# Altium project LimePSB-RPCM_1v4.PrjPcb (part 12 of 12)
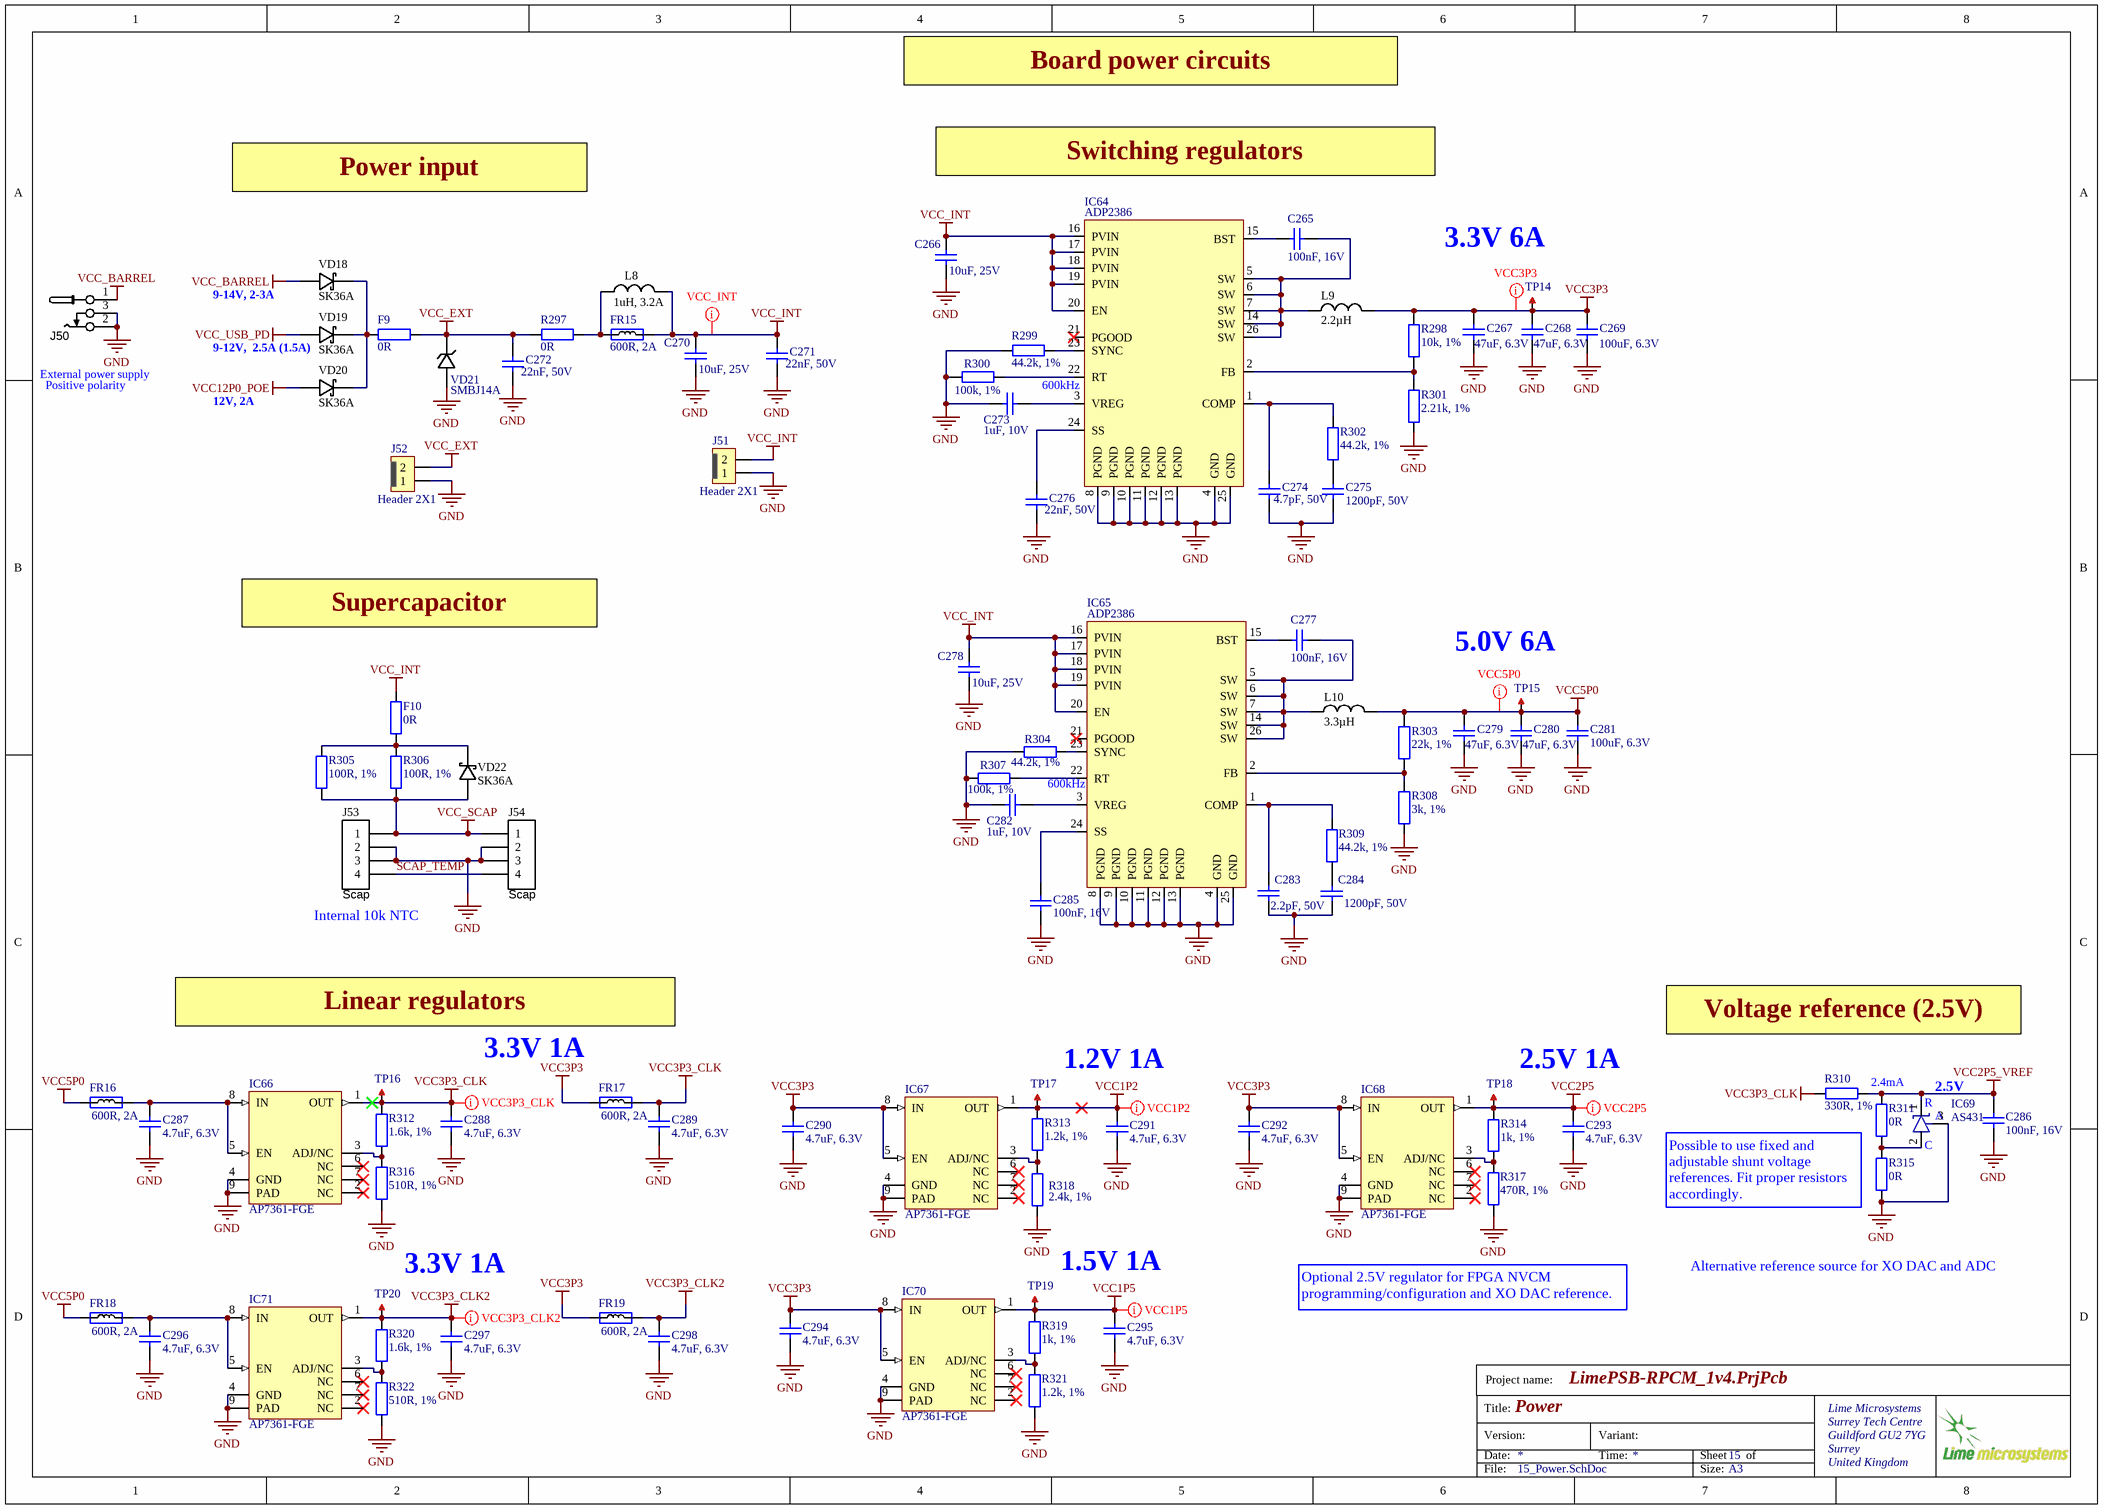
[diagram p16: 15_Power.SchDoc]

## Nets that join several sheets
GND: 05_RPi_mPCIe (86 pins), 06_Misc_1 (63 pins), 07_Misc_2 (82 pins), 08_FPGA (35 pins), 09_USB_hub (67 pins), 10_USB_HDMI (80 pins), 11_Clock_1 (82 pins), 12_Clock_2 (81 pins), 13_RFFE (136 pins), 14_RFPD_PoE_USB_PD (51 pins), 15_Power (80 pins)
USB_VBUS_IN: 09_USB_hub (6 pins), 14_RFPD_PoE_USB_PD (7 pins)
VCC1P2: 08_FPGA (7 pins), 15_Power (C291.2 IC67.1 R313.1 TP17.1)
VCC1P5: 05_RPi_mPCIe (J3.6 J3.28 J3.48), 15_Power (C295.2 IC70.1 R319.2 TP19.1)
VCC2P5: 08_FPGA (R117.2), 11_Clock_1 (R202.2), 14_RFPD_PoE_USB_PD (R329.2), 15_Power (C293.2 IC68.1 R314.2 TP18.1)
VCC2P5_VREF: 07_Misc_2 (R50.1), 11_Clock_1 (R197.2), 14_RFPD_PoE_USB_PD (R327.2), 15_Power (C286.2 IC69.1 R310.1 R311.1)
VCC3P0_BATT: 07_Misc_2 (BATT1.POSITIVE D1.A2 R87.2), 12_Clock_2 (J40.2 R258.2)
VCC3P3: 05_RPi_mPCIe (9 pins), 06_Misc_1 (26 pins), 07_Misc_2 (38 pins), 08_FPGA (20 pins), 09_USB_hub (28 pins), 10_USB_HDMI (9 pins), 12_Clock_2 (12 pins), 13_RFFE (R263.2 R264.2 R269.2 R270.2), 15_Power (17 pins)
VCC3P3_CLK: 11_Clock_1 (19 pins), 12_Clock_2 (10 pins), 14_RFPD_PoE_USB_PD (FR21.2 FR23.2 R328.1), 15_Power (7 pins)
VCC3P3_CLK2: 12_Clock_2 (FR9.1 FR10.1 FR11.1 FR12.1), 15_Power (6 pins)
VCC5P0: 05_RPi_mPCIe (8 pins), 06_Misc_1 (6 pins), 07_Misc_2 (6 pins), 09_USB_hub (8 pins), 10_USB_HDMI (11 pins), 13_RFFE (FR13.1 FR14.1), 15_Power (8 pins)
VCC12P0_POE: 07_Misc_2 (R58.1), 14_RFPD_PoE_USB_PD (C320.1 C321.2 L13.2 TP21.1), 15_Power (VD20.A)
VCC_BARREL: 07_Misc_2 (R56.1), 15_Power (J50.1 VD18.A)
VCC_EXT: 07_Misc_2 (R59.1), 15_Power (5 pins)
VCC_INT: 07_Misc_2 (R60.1 R89.1), 15_Power (18 pins)
VCC_SCAP: 07_Misc_2 (R61.1), 15_Power (5 pins)
VCC_USB_PD: 07_Misc_2 (R57.1), 14_RFPD_PoE_USB_PD (C329.2 IC75.5 IC75.6 IC76.11), 15_Power (VD19.A)
ADF_MUXOUT: 07_Misc_2 (IC15.1), 11_Clock_1 (IC37.15 R205.1)
ADF_REFIN_SEL: 07_Misc_2 (IC15.20), 11_Clock_1 (IC33.6)
BUZZER: 05_RPi_mPCIe (J1.34), 06_Misc_1 (R30.1 R33.1 VT1.G)
CAM1_CLK_N: 05_RPi_mPCIe (J2.27), 06_Misc_1 (J16.8)
CAM1_CLK_P: 05_RPi_mPCIe (J2.29), 06_Misc_1 (J16.9)
CAM1_D0_N: 05_RPi_mPCIe (J2.15), 06_Misc_1 (J16.2)
CAM1_D0_P: 05_RPi_mPCIe (J2.17), 06_Misc_1 (J16.3)
CAM1_D1_N: 05_RPi_mPCIe (J2.21), 06_Misc_1 (J16.5)
CAM1_D1_P: 05_RPi_mPCIe (J2.23), 06_Misc_1 (J16.6)
CAM1_GPIO0: 05_RPi_mPCIe (J1.97), 06_Misc_1 (J16.11)
DSI1_CLK_N: 05_RPi_mPCIe (J2.87), 06_Misc_1 (J15.5)
DSI1_CLK_P: 05_RPi_mPCIe (J2.89), 06_Misc_1 (J15.6)
DSI1_D0_N: 05_RPi_mPCIe (J2.75), 06_Misc_1 (J15.8)
DSI1_D0_P: 05_RPi_mPCIe (J2.77), 06_Misc_1 (J15.9)
DSI1_D1_N: 05_RPi_mPCIe (J2.81), 06_Misc_1 (J15.2)
DSI1_D1_P: 05_RPi_mPCIe (J2.83), 06_Misc_1 (J15.3)
EN_CM5_USB3: 05_RPi_mPCIe (IC1.6), 06_Misc_1 (DSW1.4), 08_FPGA (IC18.4), 10_USB_HDMI (6 pins)
EN_RXA_LNA: 07_Misc_2 (IC12.26), 13_RFFE (IC61.3 R276.2 R286.1)
EN_RXB_LNA: 07_Misc_2 (IC12.28), 13_RFFE (IC63.3 R278.2 R288.1)
EN_TXA_PA: 07_Misc_2 (IC12.25), 13_RFFE (IC60.3 R275.2 R285.1)
EN_TXB_PA: 07_Misc_2 (IC12.27), 13_RFFE (IC62.3 R277.2 R287.1)
ETH_LED_G: 05_RPi_mPCIe (J1.17), 06_Misc_1 (R31.2)
ETH_LED_Y: 05_RPi_mPCIe (J1.15), 06_Misc_1 (R32.2)
ETH_TRD0_N: 05_RPi_mPCIe (J1.10), 06_Misc_1 (J9.2 VD2.A)
ETH_TRD0_P: 05_RPi_mPCIe (J1.12), 06_Misc_1 (J9.1 VD1.A)
ETH_TRD1_N: 05_RPi_mPCIe (J1.6), 06_Misc_1 (J9.6 VD4.A)
ETH_TRD1_P: 05_RPi_mPCIe (J1.4), 06_Misc_1 (J9.3 VD3.A)
ETH_TRD2_N: 05_RPi_mPCIe (J1.9), 06_Misc_1 (J9.8 VD6.A)
ETH_TRD2_P: 05_RPi_mPCIe (J1.11), 06_Misc_1 (J9.7 VD5.A)
ETH_TRD3_N: 05_RPi_mPCIe (J1.5), 06_Misc_1 (J9.10 VD8.A)
ETH_TRD3_P: 05_RPi_mPCIe (J1.3), 06_Misc_1 (J9.9 VD7.A)
ETH_VC1: 06_Misc_1 (J9.11 J13.2), 14_RFPD_PoE_USB_PD (BR1.4)
ETH_VC2: 06_Misc_1 (J9.12 J13.1), 14_RFPD_PoE_USB_PD (BR1.3)
ETH_VC3: 06_Misc_1 (J9.13 J13.4), 14_RFPD_PoE_USB_PD (BR2.4)
ETH_VC4: 06_Misc_1 (J9.14 J13.3), 14_RFPD_PoE_USB_PD (BR2.3)
EXT_SYNC_IN: 11_Clock_1 (IC33.3 J36.1 R187.2), 12_Clock_2 (6 pins)
EXT_SYNC_OUT_A0: 07_Misc_2 (IC15.17), 11_Clock_1 (IC32.1)
EXT_SYNC_OUT_A1: 07_Misc_2 (IC15.18), 11_Clock_1 (IC32.10)
EXT_SYNC_OUT_EN: 07_Misc_2 (IC15.19), 11_Clock_1 (IC32.5)
FPGA_CDONE: 07_Misc_2 (IC15.26), 08_FPGA (IC18.7 J28.3 R107.1 R108.1)
FPGA_CDONE_LED: 07_Misc_2 (IC15.27), 08_FPGA (R104.1)
FPGA_CRESET: 07_Misc_2 (IC15.25), 08_FPGA (C54.1 IC18.8 J28.2 R109.2)
FPGA_GPIO0: 06_Misc_1 (J10.12), 08_FPGA (IC18.45)
FPGA_GPIO1: 06_Misc_1 (J10.14), 08_FPGA (IC18.21)
FPGA_RF_SW_TDD: 07_Misc_2 (R43.2), 08_FPGA (IC18.13)
FPGA_SPI0_DAC_SS: 08_FPGA (IC18.42), 11_Clock_1 (R214.2)
FPGA_SPI0_MOSI: 08_FPGA (IC18.38), 11_Clock_1 (R216.2)
FPGA_SPI0_SCLK: 08_FPGA (IC18.43), 11_Clock_1 (R215.2)
FPGA_SYNC_OUT: 08_FPGA (IC18.3), 12_Clock_2 (IC42.1 R229.2)
GNSS _DDC_SCL: 08_FPGA (IC18.28), 12_Clock_2 (IC48.19)
GNSS _DDC_SDA: 08_FPGA (IC18.27), 12_Clock_2 (IC48.18)
GNSS_EXTINT: 08_FPGA (IC18.25), 12_Clock_2 (IC48.4)
GNSS_RESET: 08_FPGA (IC18.23), 12_Clock_2 (R252.1)
GNSS_RF_IN: 07_Misc_2 (R69.2), 12_Clock_2 (C199.1 L1.1 R248.2)
GNSS_TPULSE: 08_FPGA (IC18.20), 12_Clock_2 (IC48.3)
GNSS_UART_RX: 08_FPGA (IC18.32), 12_Clock_2 (IC48.21)
GNSS_UART_TX: 08_FPGA (IC18.31), 12_Clock_2 (IC48.20)
GNSS_USB_D_N: 09_USB_hub (R138.1), 12_Clock_2 (IC48.5)
GNSS_USB_D_P: 09_USB_hub (R136.1), 12_Clock_2 (IC48.6)
HDMI0_CEC: 05_RPi_mPCIe (J2.51), 10_USB_HDMI (ESD15.1 J34.15)
HDMI0_CLK_N: 05_RPi_mPCIe (J2.90), 10_USB_HDMI (ESD14.1 J34.14)
HDMI0_CLK_P: 05_RPi_mPCIe (J2.88), 10_USB_HDMI (ESD13.1 J34.12)
HDMI0_D0_N: 05_RPi_mPCIe (J2.84), 10_USB_HDMI (ESD12.1 J34.11)
HDMI0_D0_P: 05_RPi_mPCIe (J2.82), 10_USB_HDMI (ESD11.1 J34.9)
HDMI0_D1_N: 05_RPi_mPCIe (J2.78), 10_USB_HDMI (ESD10.1 J34.8)
HDMI0_D1_P: 05_RPi_mPCIe (J2.76), 10_USB_HDMI (ESD9.1 J34.6)
HDMI0_D2_N: 05_RPi_mPCIe (J2.72), 10_USB_HDMI (ESD8.1 J34.5)
HDMI0_D2_P: 05_RPi_mPCIe (J2.70), 10_USB_HDMI (ESD7.1 J34.3)
HDMI0_HPD: 05_RPi_mPCIe (J2.53), 10_USB_HDMI (ESD18.1 J34.1)
HDMI0_SCL: 05_RPi_mPCIe (J2.100), 10_USB_HDMI (ESD16.1 J34.17)
HDMI0_SDA: 05_RPi_mPCIe (J2.99), 10_USB_HDMI (ESD17.1 J34.18)
HDMI1_CEC: 05_RPi_mPCIe (J2.49), 10_USB_HDMI (ESD27.1 J35.15)
HDMI1_CLK_N: 05_RPi_mPCIe (J2.66), 10_USB_HDMI (ESD26.1 J35.14)
HDMI1_CLK_P: 05_RPi_mPCIe (J2.64), 10_USB_HDMI (ESD25.1 J35.12)
HDMI1_D0_N: 05_RPi_mPCIe (J2.60), 10_USB_HDMI (ESD24.1 J35.11)
HDMI1_D0_P: 05_RPi_mPCIe (J2.58), 10_USB_HDMI (ESD23.1 J35.9)
HDMI1_D1_N: 05_RPi_mPCIe (J2.54), 10_USB_HDMI (ESD22.1 J35.8)
HDMI1_D1_P: 05_RPi_mPCIe (J2.52), 10_USB_HDMI (ESD21.1 J35.6)
HDMI1_D2_N: 05_RPi_mPCIe (J2.48), 10_USB_HDMI (ESD20.1 J35.5)
HDMI1_D2_P: 05_RPi_mPCIe (J2.46), 10_USB_HDMI (ESD19.1 J35.3)
HDMI1_HPD: 05_RPi_mPCIe (J2.43), 10_USB_HDMI (ESD30.1 J35.1)
HDMI1_SCL: 05_RPi_mPCIe (J2.47), 10_USB_HDMI (ESD28.1 J35.17)
HDMI1_SDA: 05_RPi_mPCIe (J2.45), 10_USB_HDMI (ESD29.1 J35.18)
LMK10_CLK_OUT0: 08_FPGA (IC18.37), 12_Clock_2 (IC39.3)
LMK10_CLK_OUT2: 11_Clock_1 (IC33.1 R186.2), 12_Clock_2 (IC39.13)
LMK10_CLK_OUT3: 11_Clock_1 (IC32.4), 12_Clock_2 (IC39.15)
LMKRF_CLK_OUT2: 11_Clock_1 (IC31.13), 12_Clock_2 (IC45.3 R240.2)
LMKRF_CLK_OUT4: 08_FPGA (IC18.35), 11_Clock_1 (IC31.17)
PCIE_COEX2: 05_RPi_mPCIe (J3.5 R4.1), 12_Clock_2 (IC40.1 R221.2)
PCIE_LED_WLAN: 05_RPi_mPCIe (J3.44), 07_Misc_2 (IC15.3)
PCIE_LED_WPAN: 05_RPi_mPCIe (J3.46), 07_Misc_2 (IC15.4)
PCIE_LED_WWAN: 05_RPi_mPCIe (J3.42), 07_Misc_2 (IC15.2)
PCIE_PPS_IN: 05_RPi_mPCIe (R3.2 R4.2 R5.2), 12_Clock_2 (IC43.4 R230.1 R233.1)
PCIE_PPS_IN_SEL: 07_Misc_2 (IC15.24), 12_Clock_2 (IC43.6)
PCIE_PPS_OUT: 11_Clock_1 (IC32.9), 12_Clock_2 (5 pins)
PCIE_PPS_OUT_SEL: 07_Misc_2 (IC15.23), 12_Clock_2 (IC40.6)
PCIE_SMB_CLK: 05_RPi_mPCIe (J3.30 R12.1), 12_Clock_2 (IC40.3 R224.2)
PCIE_UIM8: 05_RPi_mPCIe (J3.17), 08_FPGA (IC18.46)
PCIE_UIMC4: 05_RPi_mPCIe (R2.1), 12_Clock_2 (IC45.4 R239.1 R240.1)
PCIE_UIMC4_SEL: 07_Misc_2 (IC15.22), 12_Clock_2 (IC45.6)
PCIE_USB_N: 05_RPi_mPCIe (J3.36), 09_USB_hub (R126.2 R130.1)
PCIE_USB_P: 05_RPi_mPCIe (J3.38), 09_USB_hub (R125.2 R127.1)
PTP_SYNC_SEL: 07_Misc_2 (IC12.3), 12_Clock_2 (IC47.10 R254.1)
RF_SW_TDD: 07_Misc_2 (J18.2 R41.2 R43.1 R44.1), 13_RFFE (R261.2 R262.2 R267.2 R268.2)
RFPD_EN: 07_Misc_2 (IC15.28), 14_RFPD_PoE_USB_PD (IC72.9 IC73.9)
RFPDA_CONV: 05_RPi_mPCIe (J1.41), 14_RFPD_PoE_USB_PD (IC72.12)
RFPDA_RFIN: 13_RFFE (IC53.6), 14_RFPD_PoE_USB_PD (C302.1 L11.1)
RFPDB_CONV: 05_RPi_mPCIe (J1.24), 14_RFPD_PoE_USB_PD (IC73.12)
RFPDB_RFIN: 13_RFFE (IC55.6), 14_RFPD_PoE_USB_PD (C313.1 L12.1)
RPI_AIP0: 05_RPi_mPCIe (J1.96), 06_Misc_1 (J12.5)
RPI_AIP1: 05_RPi_mPCIe (J1.94), 06_Misc_1 (J12.6)
RPI_BTN1: 05_RPi_mPCIe (J1.45), 06_Misc_1 (R29.1)
RPI_BTN2: 05_RPi_mPCIe (J1.47), 06_Misc_1 (C10.1 J8.5 R15.2)
RPI_EEPROM_nWP: 05_RPi_mPCIe (J1.20), 06_Misc_1 (J12.4 R34.2)
RPI_GLOBAL_EN: 05_RPi_mPCIe (J1.99 J5.1), 06_Misc_1 (J12.14), 07_Misc_2 (R102.1)
RPI_GPIO2: 05_RPi_mPCIe (J1.58), 06_Misc_1 (J10.15)
RPI_GPIO3: 05_RPi_mPCIe (J1.56), 06_Misc_1 (J10.6)
RPI_GPIO4: 05_RPi_mPCIe (J1.54), 06_Misc_1 (J10.16)
RPI_GPIO6: 05_RPi_mPCIe (J1.30), 06_Misc_1 (J10.7)
RPI_GPIO22: 05_RPi_mPCIe (J1.46), 06_Misc_1 (J10.3)
RPI_GPIO27: 05_RPi_mPCIe (J1.48), 06_Misc_1 (J10.5)
RPI_I2C0_SCL: 05_RPi_mPCIe (J1.80 R12.2), 06_Misc_1 (J15.11 J16.13), 07_Misc_2 (12 pins), 08_FPGA (R111.1), 09_USB_hub (R154.2), 14_RFPD_PoE_USB_PD (R349.2)
RPI_I2C0_SDA: 05_RPi_mPCIe (J1.82 R13.2), 06_Misc_1 (J15.12 J16.14), 07_Misc_2 (12 pins), 08_FPGA (R112.1), 09_USB_hub (R153.2), 14_RFPD_PoE_USB_PD (R348.2)
RPI_ID_SC: 05_RPi_mPCIe (J1.35), 06_Misc_1 (J8.3 J10.18 R19.1)
RPI_ID_SD: 05_RPi_mPCIe (J1.36), 06_Misc_1 (J8.4 J10.17 R16.1)
RPI_LED_nPWR: 05_RPi_mPCIe (J1.95), 06_Misc_1 (IC2.2 R14.2 R17.2)
RPI_nEXTRST: 05_RPi_mPCIe (J1.100), 09_USB_hub (R132.2)
RPI_nRPIBOOT: 05_RPi_mPCIe (J1.93), 06_Misc_1 (DSW1.1 J12.2)
RPI_PIN16: 05_RPi_mPCIe (J1.16), 12_Clock_2 (IC47.2 R245.2 R251.1)
RPI_PIN18: 05_RPi_mPCIe (J1.18), 12_Clock_2 (IC47.1 R244.2 R250.1)
RPI_PIN111: 05_RPi_mPCIe (IC1.4 J2.11 R9.2 R11.2), 06_Misc_1 (J12.11)
RPI_PWM0: 05_RPi_mPCIe (J1.31), 06_Misc_1 (IC5.3)
RPI_PWM1: 05_RPi_mPCIe (J1.28), 06_Misc_1 (IC5.1)
RPI_RUN_PG: 05_RPi_mPCIe (J1.92 J5.3), 06_Misc_1 (IC3.2 J12.10 R22.2 R27.1)
RPI_SD_CLK: 05_RPi_mPCIe (J1.57), 06_Misc_1 (J7.5)
RPI_SD_CMD: 05_RPi_mPCIe (J1.62), 06_Misc_1 (J7.3)
RPI_SD_D0: 05_RPi_mPCIe (J1.63), 06_Misc_1 (J7.7)
RPI_SD_D1: 05_RPi_mPCIe (J1.67), 06_Misc_1 (J7.8)
RPI_SD_D2: 05_RPi_mPCIe (J1.69), 06_Misc_1 (J7.1)
RPI_SD_D3: 05_RPi_mPCIe (J1.61), 06_Misc_1 (J7.2)
RPI_SD_PWR_ON: 05_RPi_mPCIe (J1.75), 06_Misc_1 (IC4.3 R23.1)
RPI_SPI0_MISO: 05_RPi_mPCIe (J1.40), 06_Misc_1 (J10.11), 08_FPGA (R116.2 R118.1), 14_RFPD_PoE_USB_PD (IC72.1 IC73.1)
RPI_SPI0_MOSI: 05_RPi_mPCIe (J1.44), 06_Misc_1 (J10.9), 08_FPGA (R114.2 R115.1), 11_Clock_1 (R211.1)
RPI_SPI0_SCLK: 05_RPi_mPCIe (J1.38), 06_Misc_1 (J10.13), 08_FPGA (R113.1), 11_Clock_1 (R209.1), 14_RFPD_PoE_USB_PD (IC72.2 IC73.2)
RPI_SPI0_SS0: 05_RPi_mPCIe (J1.39), 08_FPGA (R119.2)
RPI_SPI0_SS1: 05_RPi_mPCIe (J1.37), 11_Clock_1 (R212.1)
RPI_SPI1_MISO: 05_RPi_mPCIe (J1.26), 07_Misc_2 (IC6.12), 08_FPGA (IC18.10)
RPI_SPI1_MOSI: 05_RPi_mPCIe (J1.27), 07_Misc_2 (IC6.11), 08_FPGA (IC18.9)
RPI_SPI1_SCLK: 05_RPi_mPCIe (J1.25), 07_Misc_2 (IC6.13), 08_FPGA (IC18.6)
RPI_SPI1_SS0: 05_RPi_mPCIe (J1.49), 07_Misc_2 (IC6.10)
RPI_SPI1_SS1: 05_RPi_mPCIe (J1.50), 08_FPGA (IC18.11)
RPI_SPI1_SS2: 05_RPi_mPCIe (J1.29), 08_FPGA (IC18.12)
RPI_STATUS_LED_G: 06_Misc_1 (IC2.4 R17.1), 07_Misc_2 (R91.1)
RPI_STATUS_LED_R: 05_RPi_mPCIe (J1.21), 07_Misc_2 (R95.1)
RPI_SYNC_IN: 06_Misc_1 (J12.8), 08_FPGA (IC18.2), 12_Clock_2 (6 pins)
RPI_SYNC_IN_SEL: 07_Misc_2 (IC15.21), 12_Clock_2 (IC41.6)
RPI_SYNC_OUT: 06_Misc_1 (J12.9), 08_FPGA (IC18.44), 12_Clock_2 (IC42.3 IC46.4 R232.2 R247.1)
RPI_TVDAC: 05_RPi_mPCIe (IC1.3 R11.1), 06_Misc_1 (J14.1 J17.4)
RPI_UART0_RX: 05_RPi_mPCIe (J1.51), 06_Misc_1 (J10.10 J11.3), 08_FPGA (IC18.34)
RPI_UART0_TX: 05_RPi_mPCIe (J1.55), 06_Misc_1 (J10.8 J11.2), 08_FPGA (IC18.36)
RPI_USB3_D0_N: 05_RPi_mPCIe (J2.36), 10_USB_HDMI (IC26.7)
RPI_USB3_D0_P: 05_RPi_mPCIe (J2.34), 10_USB_HDMI (IC26.6)
RPI_USB3_D1_N: 05_RPi_mPCIe (J2.65), 10_USB_HDMI (IC27.7)
RPI_USB3_D1_P: 05_RPi_mPCIe (J2.63), 10_USB_HDMI (IC27.6)
RPI_USB3_RX0_N: 05_RPi_mPCIe (J2.28), 10_USB_HDMI (IC29.4)
RPI_USB3_RX0_P: 05_RPi_mPCIe (J2.30), 10_USB_HDMI (IC29.5)
RPI_USB3_RX1_N: 05_RPi_mPCIe (J2.57), 10_USB_HDMI (IC30.4)
RPI_USB3_RX1_P: 05_RPi_mPCIe (J2.59), 10_USB_HDMI (IC30.5)
RPI_USB3_TX0_N: 05_RPi_mPCIe (J2.40), 10_USB_HDMI (IC29.1)
RPI_USB3_TX0_P: 05_RPi_mPCIe (J2.42), 10_USB_HDMI (IC29.2)
RPI_USB3_TX1_N: 05_RPi_mPCIe (J2.69), 10_USB_HDMI (IC30.1)
RPI_USB3_TX1_P: 05_RPi_mPCIe (J2.71), 10_USB_HDMI (IC30.2)
RPI_USB_D_N: 05_RPi_mPCIe (J2.3), 09_USB_hub (IC21.2 R152.2)
RPI_USB_D_P: 05_RPi_mPCIe (J2.5), 09_USB_hub (IC21.1 R151.2)
RPI_USB_OTG_ID: 05_RPi_mPCIe (J2.1), 09_USB_hub (R137.1 R145.2)
RPI_VBAT: 05_RPi_mPCIe (J1.76), 07_Misc_2 (R87.1)
RPI_VBUS_EN: 05_RPi_mPCIe (IC1.1 R9.1), 10_USB_HDMI (R167.2)
SCAP_TEMP: 07_Misc_2 (C32.1 IC6.7 R48.2 R53.1), 15_Power (J53.4 J54.4)
SYNC_OUT: 11_Clock_1 (IC32.2), 12_Clock_2 (5 pins)
SYNC_OUT_SEL: 07_Misc_2 (IC12.2), 12_Clock_2 (IC42.6)
USB3H_1_D_N: 09_USB_hub (J31.5 VD12.A), 10_USB_HDMI (IC27.1)
USB3H_1_D_P: 09_USB_hub (J31.3 VD13.A), 10_USB_HDMI (IC27.2)
USB3H_1_RX_N: 09_USB_hub (ESD3.1 J31.17), 10_USB_HDMI (IC30.9)
USB3H_1_RX_P: 09_USB_hub (ESD4.1 J31.15), 10_USB_HDMI (IC30.8)
USB3H_1_TX_N: 09_USB_hub (ESD5.1 J31.11), 10_USB_HDMI (C106.2)
USB3H_1_TX_P: 09_USB_hub (ESD6.1 J31.9), 10_USB_HDMI (C108.2)
USB_C_RPI1: 06_Misc_1 (DSW1.2), 09_USB_hub (J30.1 R144.1 R149.1)
USB_C_RPI2: 06_Misc_1 (DSW1.7), 09_USB_hub (J30.2 R139.1 R140.1 R144.2)
USB_CC1: 09_USB_hub (J29.A5), 14_RFPD_PoE_USB_PD (C335.1 IC76.15)
USB_CC2: 09_USB_hub (J29.B5), 14_RFPD_PoE_USB_PD (C334.1 IC76.14)
USB_HUB_D2_N: 09_USB_hub (IC20.3), 10_USB_HDMI (IC26.5)
USB_HUB_D2_P: 09_USB_hub (IC20.4), 10_USB_HDMI (IC26.4)
USB_HUB_D3_N: 09_USB_hub (IC20.6), 10_USB_HDMI (IC27.5)
USB_HUB_D3_P: 09_USB_hub (IC20.7), 10_USB_HDMI (IC27.4)
USB_HUB_D4_N: 09_USB_hub (IC20.8), 10_USB_HDMI (J33.2 VD14.A)
USB_HUB_D4_P: 09_USB_hub (IC20.9), 10_USB_HDMI (J33.3 VD15.A)
USB_HUB_OCS_24: 09_USB_hub (IC20.21 IC20.27), 10_USB_HDMI (R169.2)
USB_HUB_PRTPWR_24: 09_USB_hub (IC20.20), 10_USB_HDMI (R165.2)
USB_PD_I: 06_Misc_1 (DSW1.3), 14_RFPD_PoE_USB_PD (J55.2 R339.1 R343.1)
XO10_VC: 11_Clock_1 (IC35.1), 12_Clock_2 (5 pins)
XO_VC_SEL: 07_Misc_2 (IC12.1), 11_Clock_1 (IC35.6)

## Assembly variants
Default: not fitted BATT2 C6 C7 C8 C18 C30 C31 C63 C92 C97 C102 C118 C119 C124 C125 C126 C134 C135 C136 C137 C147 C156 C157 C163 C172 C173 C178 C179 C180 C189 C190 C191 C192 C194 C195 C200 C201 C257 C258 C259 C260 C269 C280 C281 C289 C293 C298 ESD35 FR15 FR17 FR19 IC9 IC10 IC16 IC19 IC22 IC23 IC34 IC38 IC44 IC46 IC49 IC68 J5 J6 J11 J13 J17 J18 J19 J20 J23 J25 J28 J30 J32 J40 J41 J54 JMP1 LED8 LED9 R1 R4 R5 R7 R9 R10 R11 R12 R13 R17 R18 R21 R22 R24 R27 R30 R34 R44 R47 R51 R52 R53 R54 R62 R70 R76 R83 R84 R86 R87 R92 R93 R96 R97 R103 R108 R114 R116 R117 R122 R124 R125 R126 R137 R139 R142 R144 R146 R148 R151 R152 R153 R154 R155 R156 R158 R161 R163 R164 R166 R167 R170 R172 R180 R181 R182 R183 R184 R185 R186 R187 R188 R189 R190 R191 R192 R198 R202 R204 R208 R210 R213 R221 R222 R223 R224 R225 R226 R227 R229 R230 R231 R232 R233 R234 R235 R236 R237 R238 R239 R240 R241 R244 R245 R246 R248 R251 R253 R255 R256 R258 R259 R263 R264 R269 R270 R271 R272 R273 R274 R275 R276 R277 R278 R279 R280 R281 R282 R283 R284 R299 R304 R305 R314 R315 R317 R325 R326 R327 R329 R330 R343 R344 R345 R347 VD9 VD21 XO2 XO3 XO4 XO5 XO7 XO8 XO9 XO10